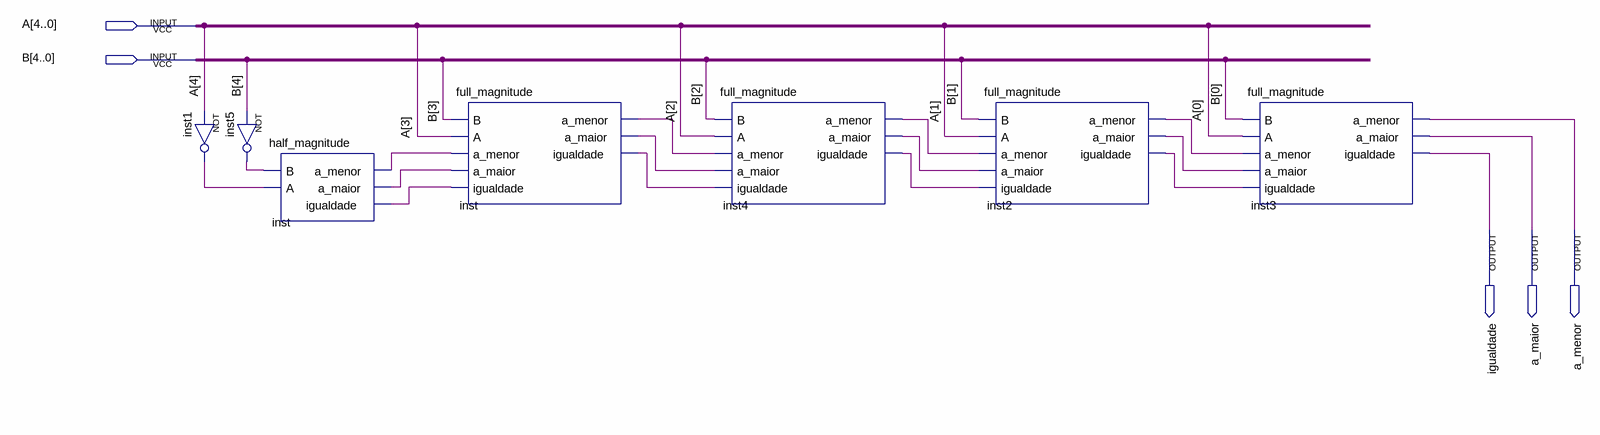
[diagram p0: schematic sheet]
// Quartus schematic modulo_magnitude_5bits.bdf as structural Verilog: 7 symbols, 5 pins
module modulo_magnitude_5bits (
  input  [4:0] A,
  input  [4:0] B,
  output igualdade,
  output a_maior,
  output a_menor
);

  wire inst1_out, inst2_a_maior, inst2_a_menor, inst2_igualdade, inst4_a_maior, inst4_a_menor,
       inst4_igualdade, inst5_out, inst_a_maior, inst_a_maior_2, inst_a_menor, inst_a_menor_2,
       inst_igualdade, inst_igualdade_2;

  not inst1 (inst1_out, A[4]);
  not inst5 (inst5_out, B[4]);
  half_magnitude inst (
    .B(inst5_out), .A(inst1_out), .a_menor(inst_a_menor_2), .a_maior(inst_a_maior_2),
    .igualdade(inst_igualdade_2));
  full_magnitude inst_dup2 (
    .B(B[3]), .A(A[3]), .a_menor({inst_a_menor_2, inst_a_menor}), .a_maior({inst_a_maior_2, inst_a_maior}),
    .igualdade({inst_igualdade_2, inst_igualdade}));
  full_magnitude inst4 (
    .B(B[2]), .A(A[2]), .a_menor({inst_a_menor, inst4_a_menor}), .a_maior({inst_a_maior, inst4_a_maior}),
    .igualdade({inst_igualdade, inst4_igualdade}));
  full_magnitude inst2 (
    .B(B[1]), .A(A[1]), .a_menor({inst4_a_menor, inst2_a_menor}), .a_maior({inst4_a_maior, inst2_a_maior}),
    .igualdade({inst4_igualdade, inst2_igualdade}));
  full_magnitude inst3 (
    .B(B[0]), .A(A[0]), .a_menor({inst2_a_menor, a_menor}), .a_maior({inst2_a_maior, a_maior}),
    .igualdade({inst2_igualdade, igualdade}));
endmodule
